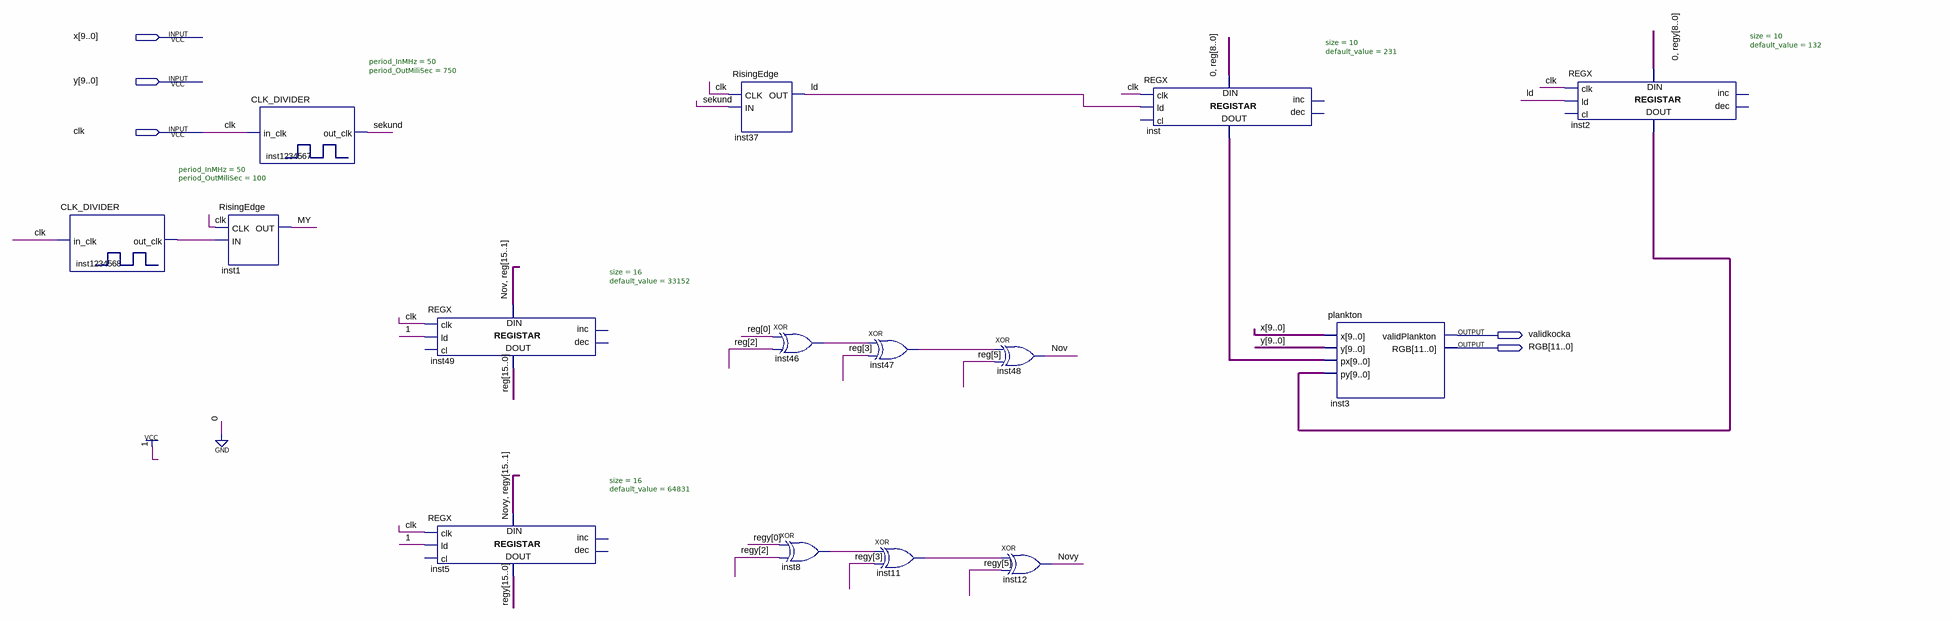
[diagram p0: schematic sheet]
// Quartus schematic prvinivo.bdf as structural Verilog: 15 symbols, 5 pins
module prvinivo (
  input  [9:0] x,
  input  [9:0] y,
  input  clk,
  output validkocka,
  output [11:0] RGB
);

  wire inst8_out, inst11_out, inst46_out, inst47_out, inst1234568_out_clk, ld, MY, Nov, Novy, sekund;
  wire [9:0] inst2_data_out, inst_data_out;
  wire [15:0] \reg , regy;

  CLK_DIVIDER #(.period_InMHz(50), .period_OutMiliSec(100)) inst1234568 (.in_clk(clk), .out_clk(inst1234568_out_clk));
  RisingEdge inst1 (.CLK(clk), .IN(inst1234568_out_clk), .OUT(MY));
  CLK_DIVIDER #(.period_InMHz(50), .period_OutMiliSec(750)) inst1234567 (.in_clk(clk), .out_clk(sekund));
  REGX #(.size(16), .default_value(33152)) inst49 (
    .clk(clk), .ld(1'b1), .data_in({Nov, \reg [15:1]}), .data_out(\reg ));  // open: cl, inc, dec
  REGX #(.size(16), .default_value(64831)) inst5 (
    .clk(clk), .ld(1'b1), .data_in({Novy, regy[15:1]}), .data_out(regy));  // open: cl, inc, dec
  RisingEdge inst37 (.CLK(clk), .IN(sekund), .OUT(ld));
  xor inst46 (inst46_out, \reg [0], \reg [2]);
  xor inst8 (inst8_out, regy[0], regy[2]);
  xor inst47 (inst47_out, inst46_out, \reg [3]);
  xor inst11 (inst11_out, inst8_out, regy[3]);
  xor inst48 (Nov, inst47_out, \reg [5]);
  xor inst12 (Novy, inst11_out, regy[5]);
  REGX #(.size(10), .default_value(231)) inst (
    .clk(clk), .ld(ld), .data_in({1'b0, \reg [8:0]}), .data_out(inst_data_out));  // open: cl, inc, dec
  plankton inst3 (.x(x), .y(y), .px(inst_data_out), .py(inst2_data_out), .validPlankton(validkocka), .RGB(RGB));
  REGX #(.size(10), .default_value(132)) inst2 (
    .clk(clk), .ld(ld), .data_in({1'b0, regy[8:0]}), .data_out(inst2_data_out));  // open: cl, inc, dec
endmodule
